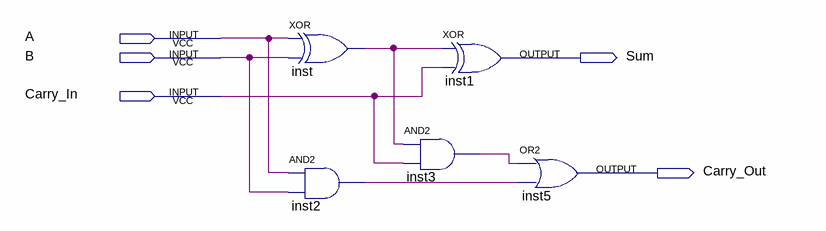
[diagram p0: schematic sheet]
// Quartus schematic fullAdder.bdf as structural Verilog: 5 symbols, 5 pins
module fullAdder (
  input  A,
  input  B,
  input  Carry_In,
  output Sum,
  output Carry_Out
);

  wire inst2_out, inst3_out, inst_out;

  xor inst (inst_out, A, B);
  and inst2 (inst2_out, A, B);
  xor inst1 (Sum, inst_out, Carry_In);
  and inst3 (inst3_out, inst_out, Carry_In);
  or inst5 (Carry_Out, inst3_out, inst2_out);
endmodule
